# EAGLE schematic Tempura_V2 (EAGLE 9.6.1)
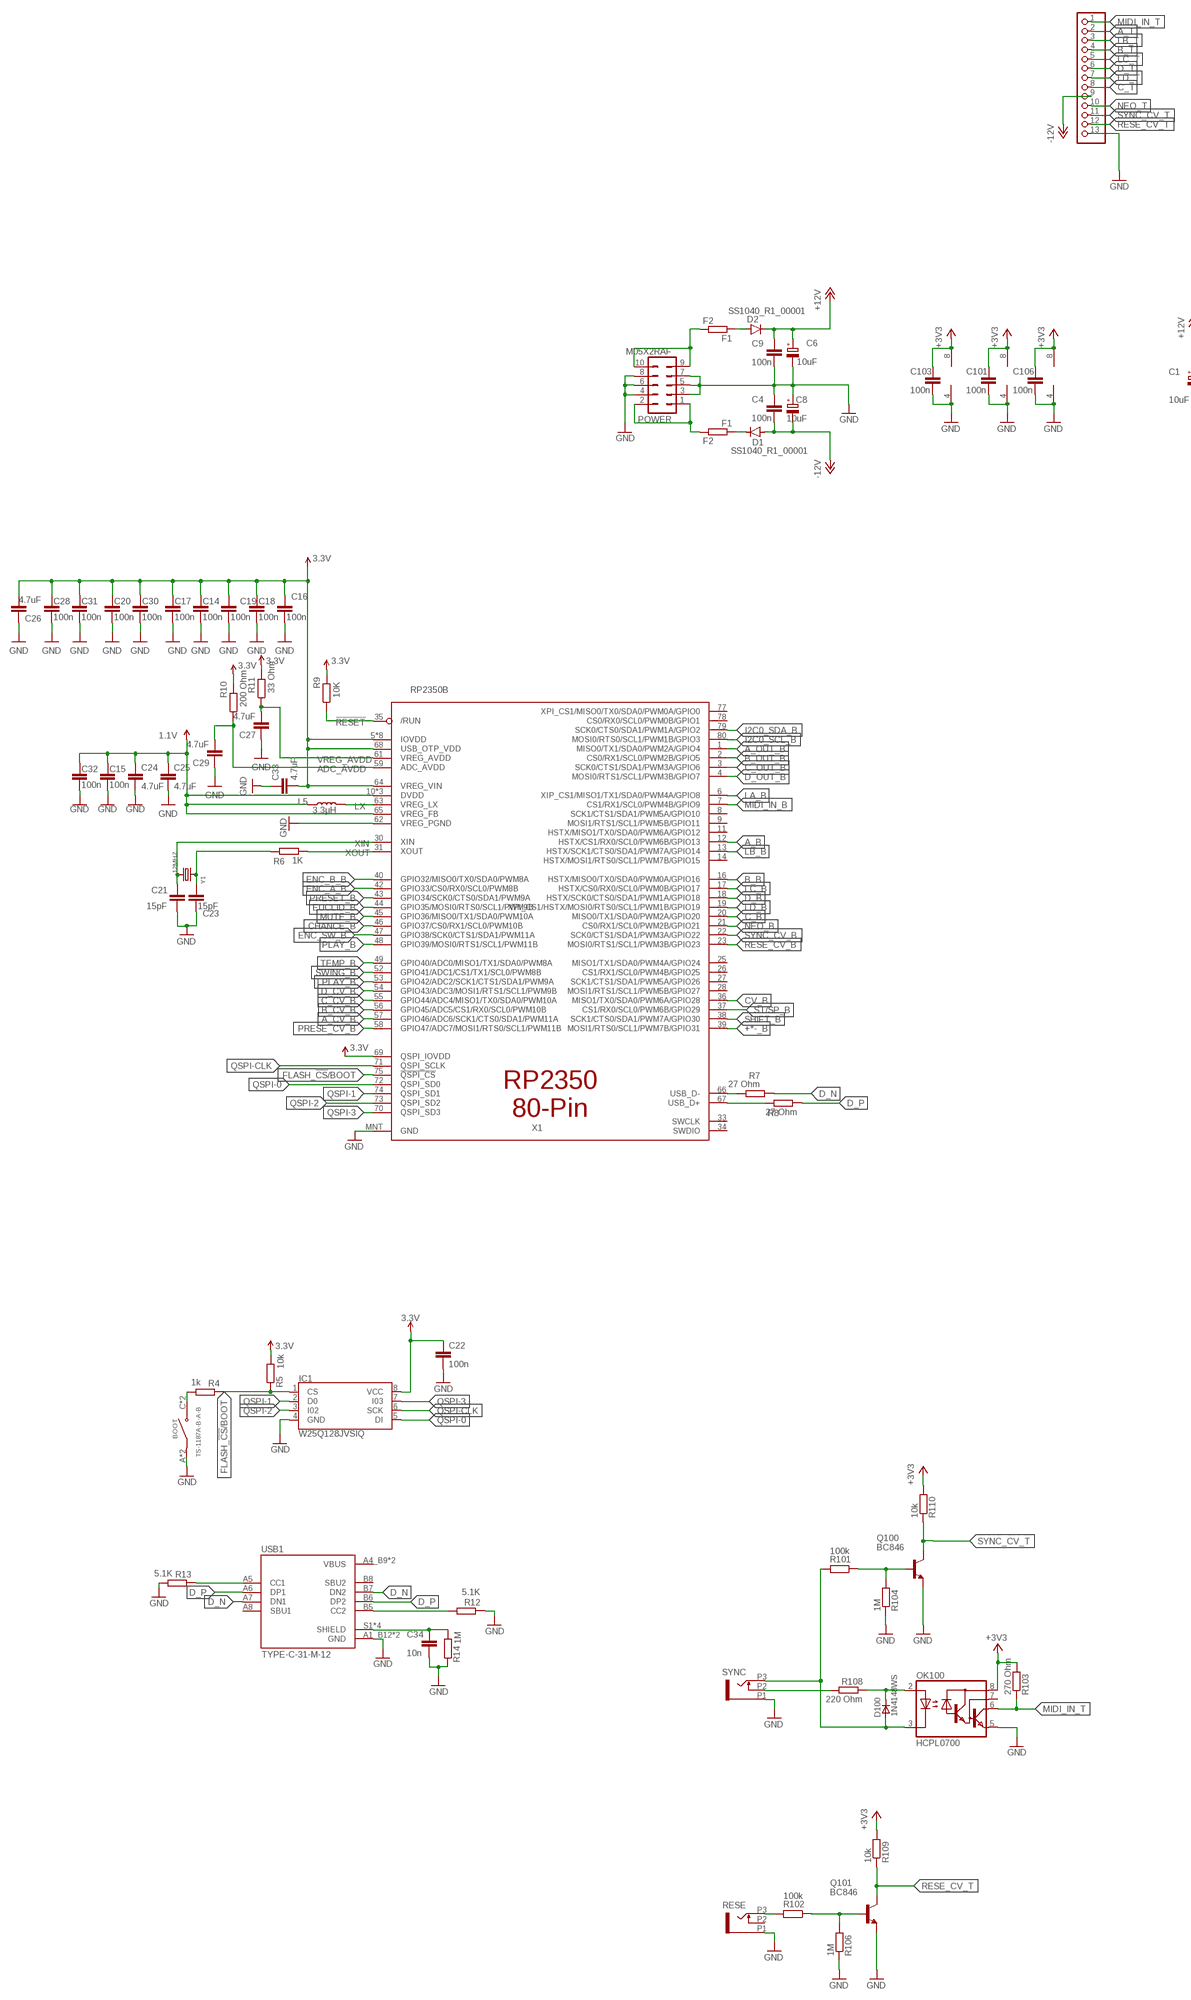
[diagram p0: schematic, sheet 1, part 1 of 3]
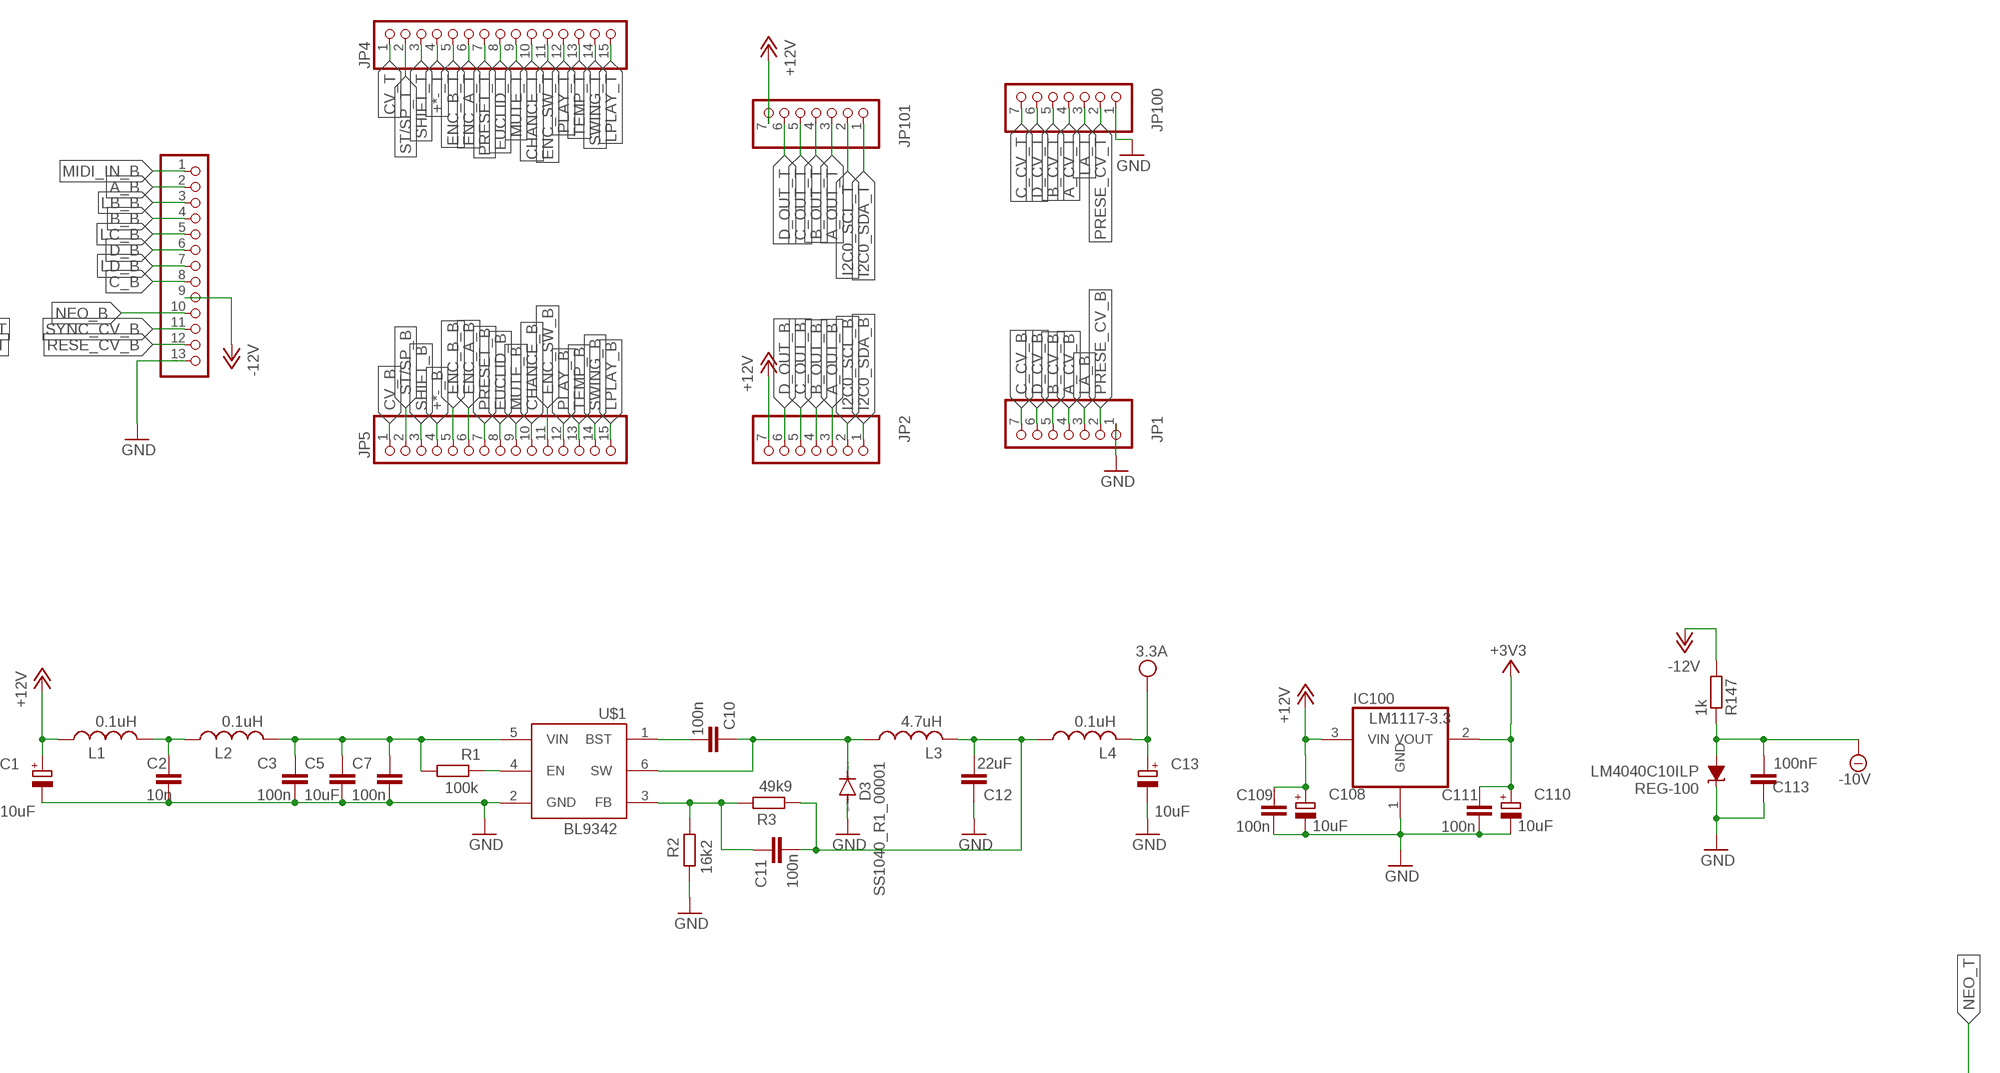
[diagram p1: schematic, sheet 1, part 2 of 3]
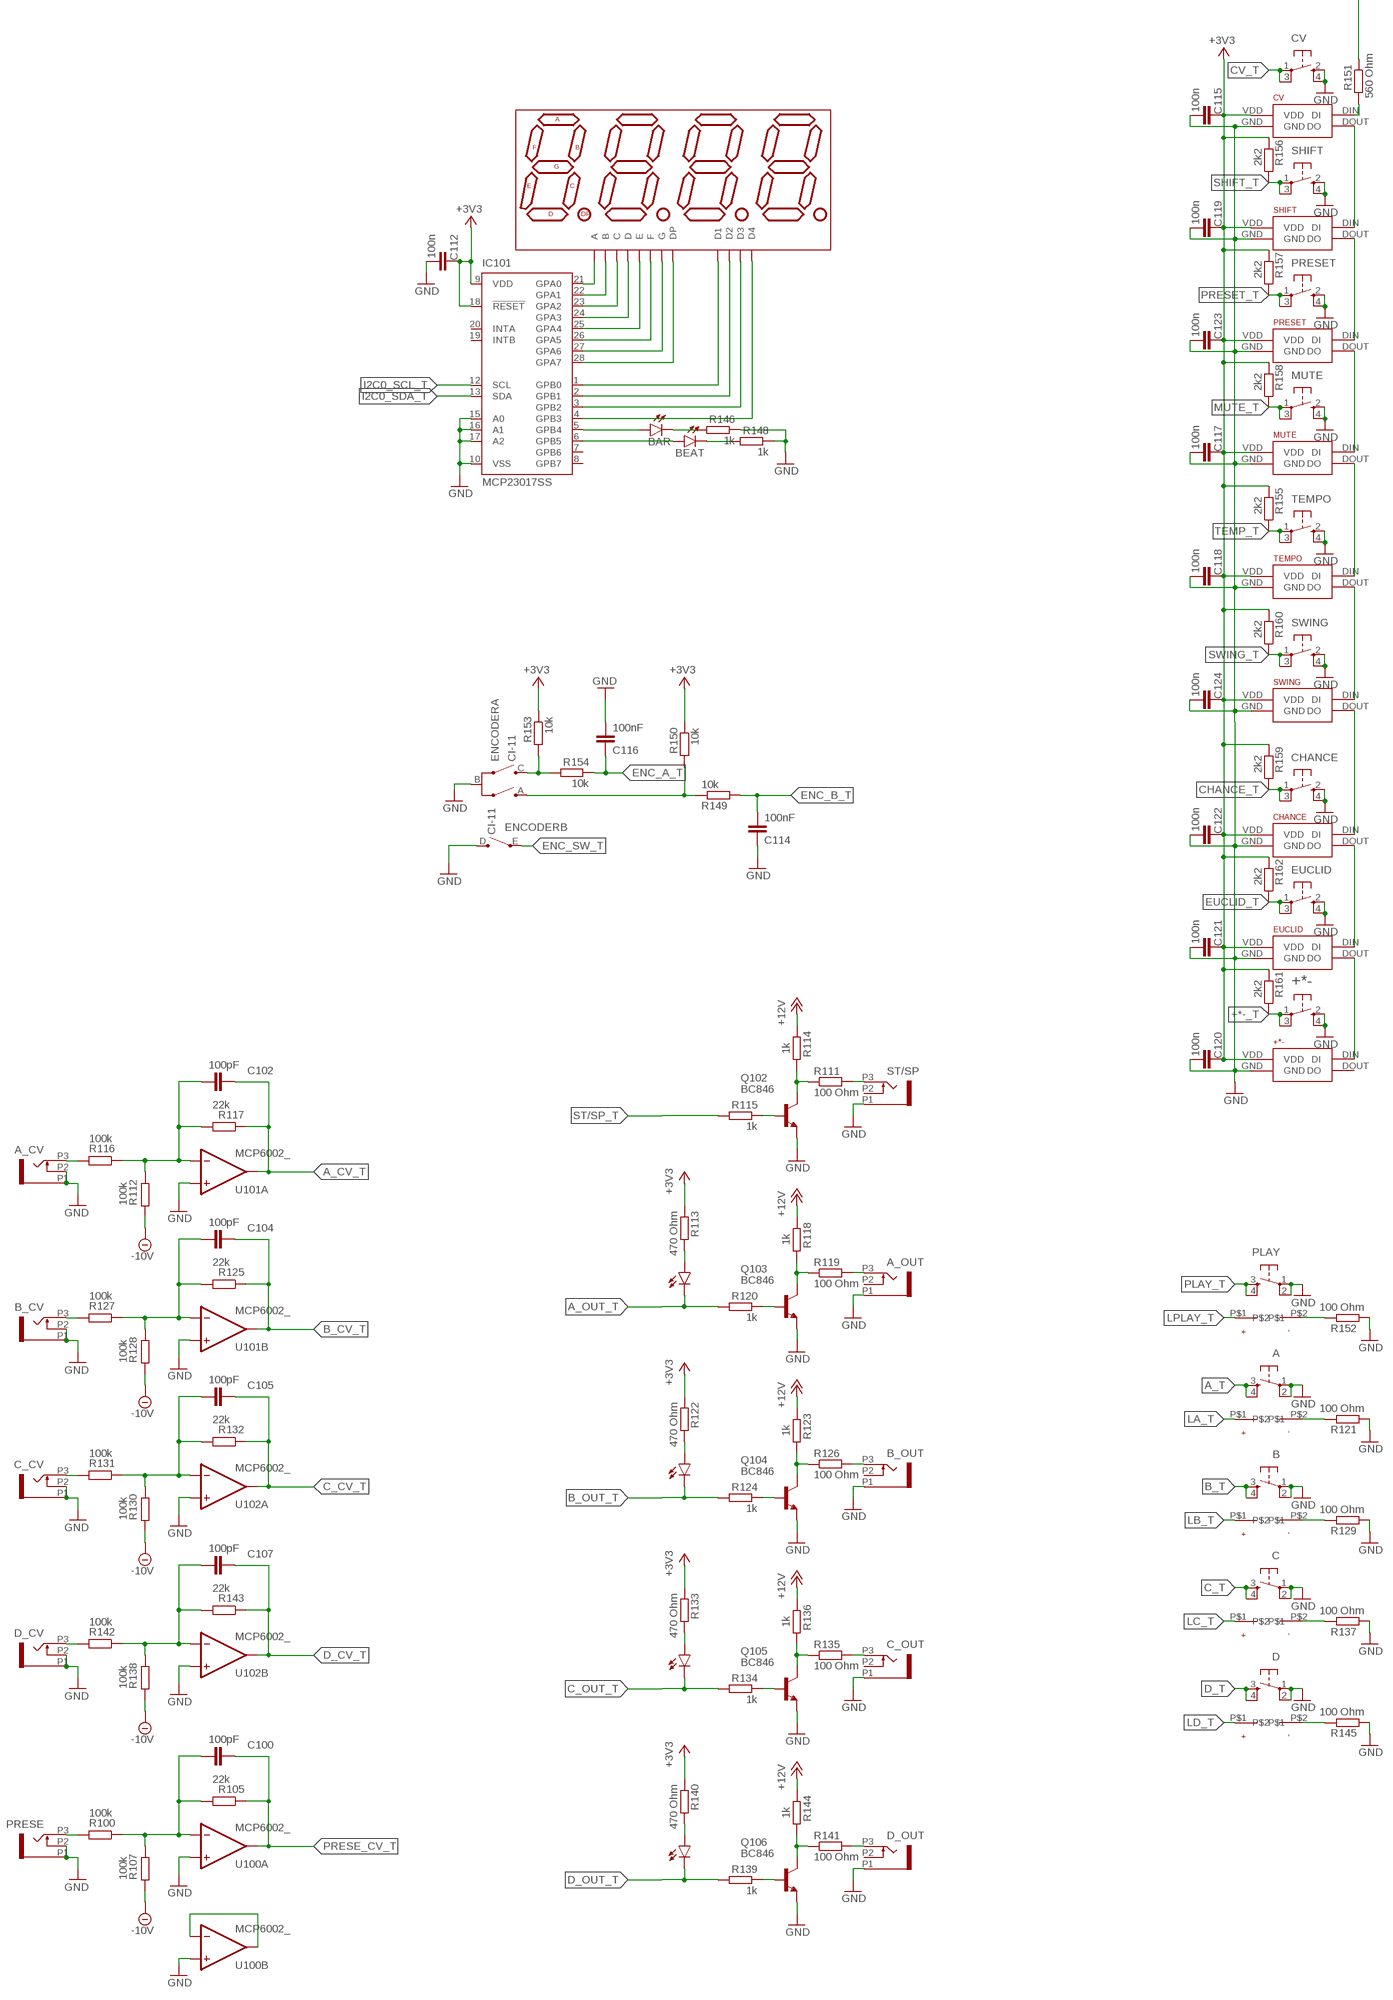
[diagram p2: schematic, sheet 1, part 3 of 3]

## Parts
+*-  BUTTON_NEOPIXELBUTTON_PIXEL_ç  [BUTTON_PIXEL_ç]
A  DTS-6_LED  [TIMEBUTTON_HOLES_LEDS]
A_CV  OG-PJ301_PJ301_THONKICONNNOHOLER  OG-PJ301_PJ301_THONKICONNNOHOLER_GND_SHORT_PADMINI_GND  [NOHOLER_GND_SHORT_PADMINI_GND]
A_OUT  OG-PJ301_PJ301_THONKICONNNOHOLER  OG-PJ301_PJ301_THONKICONNNOHOLER_GND_SHORT_PADMINI_GND  [NOHOLER_GND_SHORT_PADMINI_GND]
B  DTS-6_LED  [TIMEBUTTON_HOLES_LEDS]
B_CV  OG-PJ301_PJ301_THONKICONNNOHOLER  OG-PJ301_PJ301_THONKICONNNOHOLER_GND_SHORT_PADMINI_GND  [NOHOLER_GND_SHORT_PADMINI_GND]
B_OUT  OG-PJ301_PJ301_THONKICONNNOHOLER  OG-PJ301_PJ301_THONKICONNNOHOLER_GND_SHORT_PADMINI_GND  [NOHOLER_GND_SHORT_PADMINI_GND]
BAR  OSG5TA7NE4B  LED3MM  [LED3MM]
BEAT  OSO5JA7NE4B  LED3MM  [LED3MM]
BOOT  TS-1187A-B-A-B  [SW_TS-1187A-B-A-B]
C  DTS-6_LED  [TIMEBUTTON_HOLES_LEDS]
C1  10uF  CPOL-EUB  [PANASONIC_B]
C2  10n  C-EUC0603  [C0603]
C3  100n  C-EUC0603  [C0603]
C4  100n  C-EUC0603  [C0603]
C5  10uF  C-EUC0603  [C0603]
C6  10uF  CPOL-EUB  [PANASONIC_B]
C7  100n  C-EUC0603  [C0603]
C8  10uF  CPOL-EUB  [PANASONIC_B]
C9  100n  C-EUC0603  [C0603]
C10  100n  C-EUC0603  [C0603]
C11  100n  C-EUC0603  [C0603]
C12  22uF  C-EUC0603  [C0603]
C13  10uF  CPOL-EUB  [PANASONIC_B]
C14  100n  0.1UF-0603-100V-10%  [0603]
C15  100n  0.1UF-0603-100V-10%  [0603]
C16  100n  0.1UF-0603-100V-10%  [0603]
C17  100n  0.1UF-0603-100V-10%  [0603]
C18  100n  0.1UF-0603-100V-10%  [0603]
C19  100n  0.1UF-0603-100V-10%  [0603]
C20  100n  0.1UF-0603-100V-10%  [0603]
C21  15pF  0.1UF-0603-100V-10%  [0603]
C22  100n  C-EUC0603  [C0603]
C23  15pF  0.1UF-0603-100V-10%  [0603]
C24  4.7uF  10UF-0603-6.3V-20%  [0603]
C25  4.7uF  10UF-0603-6.3V-20%  [0603]
C26  4.7uF  C-EUC0603  [C0603]
C27  4.7uF  C-EUC0805  [C0805]
C28  100n  0.1UF-0603-100V-10%  [0603]
C29  4.7uF  C-EUC0805  [C0805]
C30  100n  0.1UF-0603-100V-10%  [0603]
C31  100n  0.1UF-0603-100V-10%  [0603]
C32  100n  0.1UF-0603-100V-10%  [0603]
C33  4.7uF  C-EUC0805  [C0805]
C34  10n  C-EUC0603  [C0603]
C100  100pF  C-EUC0603  [C0603]
C101  100n  C-EUC0603  [C0603]
C102  100pF  C-EUC0603  [C0603]
C103  100n  C-EUC0603  [C0603]
C104  100pF  C-EUC0603  [C0603]
C105  100pF  C-EUC0603  [C0603]
C106  100n  C-EUC0603  [C0603]
C107  100pF  C-EUC0603  [C0603]
C108  10uF  CPOL-EUB  [PANASONIC_B]
C109  100n  C-EUC0603  [C0603]
C110  10uF  CPOL-EUB  [PANASONIC_B]
C111  100n  C-EUC0603  [C0603]
C112  100n  C-EUC0603  [C0603]
C113  100nF  C-EUC0603  [C0603]
C114  100nF  C-EUC0603  [C0603]
C115  100n  C-EUC0603  [C0603]
C116  100nF  C-EUC0603  [C0603]
C117  100n  C-EUC0603  [C0603]
C118  100n  C-EUC0603  [C0603]
C119  100n  C-EUC0603  [C0603]
C120  100n  C-EUC0603  [C0603]
C121  100n  C-EUC0603  [C0603]
C122  100n  C-EUC0603  [C0603]
C123  100n  C-EUC0603  [C0603]
C124  100n  C-EUC0603  [C0603]
C_CV  OG-PJ301_PJ301_THONKICONNNOHOLER  OG-PJ301_PJ301_THONKICONNNOHOLER_GND_SHORT_PADMINI_GND  [NOHOLER_GND_SHORT_PADMINI_GND]
C_OUT  OG-PJ301_PJ301_THONKICONNNOHOLER  OG-PJ301_PJ301_THONKICONNNOHOLER_GND_SHORT_PADMINI_GND  [NOHOLER_GND_SHORT_PADMINI_GND]
CHANCE  BUTTON_NEOPIXELBUTTON_PIXEL_ç  [BUTTON_PIXEL_ç]
CV  BUTTON_NEOPIXELBUTTON_PIXEL_ç  [BUTTON_PIXEL_ç]
D  DTS-6_LED  [TIMEBUTTON_HOLES_LEDS]
D1  SS1040_R1_00001  DIODE-SOD123  [SOD123]
D2  SS1040_R1_00001  DIODE-SOD123  [SOD123]
D3  SS1040_R1_00001  DIODE-SOD123  [SOD123]
D100  1N4148WS  [SOD323F]
D_CV  OG-PJ301_PJ301_THONKICONNNOHOLER  OG-PJ301_PJ301_THONKICONNNOHOLER_GND_SHORT_PADMINI_GND  [NOHOLER_GND_SHORT_PADMINI_GND]
D_OUT  OG-PJ301_PJ301_THONKICONNNOHOLER  OG-PJ301_PJ301_THONKICONNNOHOLER_GND_SHORT_PADMINI_GND  [NOHOLER_GND_SHORT_PADMINI_GND]
ENCODER  CI-11  [CI-11]
EUCLID  BUTTON_NEOPIXELBUTTON_PIXEL_ç  [BUTTON_PIXEL_ç]
F1  F2  R-EU_R0603  [R0603]
F2  F1  R-EU_R0603  [R0603]
IC1  W25Q128JVSIQ  [SOIC-8]
IC100  LM1117-3.3  REG1117  [SOT223]
IC101  MCP23017SS  [SSOP28]
JP1  PINHD-1X7ç  [1X07ç]
JP2  PINHD-1X7ç  [1X07ç]
JP3  PINHD-1X131X13ç  [1X13ç]
JP4  PINHD-1X151X15ç  [1X15ç]
JP5  PINHD-1X151X15ç  [1X15ç]
JP100  PINHD-1X7ç  [1X07ç]
JP101  PINHD-1X7ç  [1X07ç]
JP102  PINHD-1X131X13ç  [1X13ç]
L1  0.1uH  L-USL3225P  [L3225P]
L2  0.1uH  L-USL3225P  [L3225P]
L3  4.7uH  L-USL3225P  [L3225P]
L4  0.1uH  L-USL3225P  [L3225P]
L5  3.3μH  4.7μH_SHIELDED_INDUCTOR  [1008(2520)]
LED_A_OUT  2 MM LED  LED3MM  [LED3MM]
LED_B_OUT  2 MM LED  LED3MM  [LED3MM]
LED_C_OUT  2 MM LED  LED3MM  [LED3MM]
LED_D_OUT  2 MM LED  LED3MM  [LED3MM]
LFD36BUE-101B  7-SEGMENT-4DIGIT-20MM  [7-SEGMENT-4DIGIT-30MM]
MUTE  BUTTON_NEOPIXELBUTTON_PIXEL_ç  [BUTTON_PIXEL_ç]
OK100  HCPL0700  [SOIC08]
PLAY  DTS-6_LED  [TIMEBUTTON_HOLES_LEDS]
POWER  M05X2RAF  [2X5-POWER_ACODADO]
PRESE  OG-PJ301_PJ301_THONKICONNNOHOLER  OG-PJ301_PJ301_THONKICONNNOHOLER_GND_SHORT_PADMINI_GND  [NOHOLER_GND_SHORT_PADMINI_GND]
PRESET  BUTTON_NEOPIXELBUTTON_PIXEL_ç  [BUTTON_PIXEL_ç]
Q100  BC846  [SOT23]
Q101  BC846  [SOT23]
Q102  BC846  [SOT23]
Q103  BC846  [SOT23]
Q104  BC846  [SOT23]
Q105  BC846  [SOT23]
Q106  BC846  [SOT23]
R1  100k  R-EU_R0603  [R0603]
R2  16k2  R-EU_R0603  [R0603]
R3  49k9  R-EU_R0603  [R0603]
R4  1k  R-EU_R0603  [R0603]
R5  10k  R-EU_R0603  [R0603]
R6  1K  R-EU_R0603  [R0603]
R7  27 Ohm  R-EU_R0603  [R0603]
R8  27 Ohm  R-EU_R0603  [R0603]
R9  10K  R-EU_R0603  [R0603]
R10  200 Ohm  R-EU_R0603  [R0603]
R11  33 Ohm  R-EU_R0603  [R0603]
R12  5.1K  R-EU_R0603  [R0603]
R13  5.1K  R-EU_R0603  [R0603]
R14  1M  R-EU_R0603  [R0603]
R100  100k  R-EU_R0603  [R0603]
R101  100k  R-EU_R0603  [R0603]
R102  100k  R-EU_R0603  [R0603]
R103  270 Ohm  R-EU_R0603  [R0603]
R104  1M  R-EU_R0603  [R0603]
R105  22k  R-EU_R0603  [R0603]
R106  1M  R-EU_R0603  [R0603]
R107  100k  R-EU_R0603  [R0603]
R108  220 Ohm  R-EU_R0603  [R0603]
R109  10k  R-EU_R0603  [R0603]
R110  10k  R-EU_R0603  [R0603]
R111  100 Ohm  R-EU_R0603  [R0603]
R112  100k  R-EU_R0603  [R0603]
R113  470 Ohm  R-EU_R0603  [R0603]
R114  1k  R-EU_R0603  [R0603]
R115  1k  R-EU_R0603  [R0603]
R116  100k  R-EU_R0603  [R0603]
R117  22k  R-EU_R0603  [R0603]
R118  1k  R-EU_R0603  [R0603]
R119  100 Ohm  R-EU_R0603  [R0603]
R120  1k  R-EU_R0603  [R0603]
R121  100 Ohm  R-EU_R0603  [R0603]
R122  470 Ohm  R-EU_R0603  [R0603]
R123  1k  R-EU_R0603  [R0603]
R124  1k  R-EU_R0603  [R0603]
R125  22k  R-EU_R0603  [R0603]
R126  100 Ohm  R-EU_R0603  [R0603]
R127  100k  R-EU_R0603  [R0603]
R128  100k  R-EU_R0603  [R0603]
R129  100 Ohm  R-EU_R0603  [R0603]
R130  100k  R-EU_R0603  [R0603]
R131  100k  R-EU_R0603  [R0603]
R132  22k  R-EU_R0603  [R0603]
R133  470 Ohm  R-EU_R0603  [R0603]
R134  1k  R-EU_R0603  [R0603]
R135  100 Ohm  R-EU_R0603  [R0603]
R136  1k  R-EU_R0603  [R0603]
R137  100 Ohm  R-EU_R0603  [R0603]
R138  100k  R-EU_R0603  [R0603]
R139  1k  R-EU_R0603  [R0603]
R140  470 Ohm  R-EU_R0603  [R0603]
R141  100 Ohm  R-EU_R0603  [R0603]
R142  100k  R-EU_R0603  [R0603]
R143  22k  R-EU_R0603  [R0603]
R144  1k  R-EU_R0603  [R0603]
R145  100 Ohm  R-EU_R0603  [R0603]
R146  1k  R-EU_R0603  [R0603]
R147  1k  R-EU_R0603  [R0603]
R148  1k  R-EU_R0603  [R0603]
R149  10k  R-EU_R0603  [R0603]
R150  10k  R-EU_R0603  [R0603]
R151  560 Ohm  R-EU_R0603  [R0603]
R152  100 Ohm  R-EU_R0603  [R0603]
R153  10k  R-EU_R0603  [R0603]
R154  10k  R-EU_R0603  [R0603]
R155  2k2  R-EU_R0603  [R0603]
R156  2k2  R-EU_R0603  [R0603]
R157  2k2  R-EU_R0603  [R0603]
R158  2k2  R-EU_R0603  [R0603]
R159  2k2  R-EU_R0603  [R0603]
R160  2k2  R-EU_R0603  [R0603]
R161  2k2  R-EU_R0603  [R0603]
R162  2k2  R-EU_R0603  [R0603]
REG-100  LM4040C10ILP  LM4041A12DBZ  [DBZ_R-PDSO-G3]
RESE  OG-PJ301_PJ301_THONKICONNNOHOLER  OG-PJ301_PJ301_THONKICONNNOHOLER_GND_SHORT_PADMINI_GND  [NOHOLER_GND_SHORT_PADMINI_GND]
SHIFT  BUTTON_NEOPIXELBUTTON_PIXEL_ç  [BUTTON_PIXEL_ç]
ST/SP  OG-PJ301_PJ301_THONKICONNNOHOLER  OG-PJ301_PJ301_THONKICONNNOHOLER_GND_SHORT_PADMINI_GND  [NOHOLER_GND_SHORT_PADMINI_GND]
SWING  BUTTON_NEOPIXELBUTTON_PIXEL_ç  [BUTTON_PIXEL_ç]
SYNC  OG-PJ301_PJ301_THONKICONNNOHOLER  OG-PJ301_PJ301_THONKICONNNOHOLER_GND_SHORT_PADMINI_GND  [NOHOLER_GND_SHORT_PADMINI_GND]
TEMPO  BUTTON_NEOPIXELBUTTON_PIXEL_ç  [BUTTON_PIXEL_ç]
U100  MCP6002_  [SO08]
U101  MCP6002_  [SO08]
U102  MCP6002_  [SO08]
U$1  BL9342  [SOT23-6]
USB1  TYPE-C-31-M-12  [HRO_TYPE-C-31-M-12]
X1  RP2350B  [QFN80]
Y1  12MHZ  CRYSTAL3.2X2.5  [CRYSTAL_3.2X2.5]

## Nets
1.1V: C15.1 C24.1 C25.1 C32.1 L5.1 X1.10(DVDD) X1.32(DVDD) X1.51(DVDD) X1.65(VREG_FB)
!RESET: R9.1 X1.35(/RUN)
+3V3: +*-.VDD C101.1 C103.1 C106.1 C110.+ C111.1 C112.1 C115.1 C117.1 C118.1 C119.1 C120.1 C121.1 C122.1 C123.1 C124.1 CHANCE.VDD CV.VDD EUCLID.VDD IC100.2(VOUT) IC101.9(VDD) IC101.18(!RESET) MUTE.VDD OK100.8(VCC) PRESET.VDD R103.2 R109.2 R110.2 R113.1 R122.1 R133.1 R140.1 R150.1 R153.1 R155.2 R156.2 R157.2 R158.2 R159.2 R160.2 R161.2 R162.2 SHIFT.VDD SWING.VDD TEMPO.VDD U100.8(P:V+) U101.8(P:V+) U102.8(P:V+)
+12V: C1.+ C6.+ C9.1 C108.+ C109.1 D2.C IC100.3(VIN) JP2.7 JP101.7 L1.1 R114.1 R118.1 R123.1 R136.1 R144.1
+*-_B: JP5.4 X1.39(MOSI1/RTS0/SCL1/PWM7B/GPIO31)
+*-_T: +*-.1 +*-.3 JP4.4 R161.1
-10V: C113.2 R107.2 R112.2 R128.2 R130.2 R138.2 R147.1 REG-100.2(A)
-12V: C4.2 C8.- D1.A JP3.9 JP102.9 R147.2
A_B: JP3.2 X1.12(HSTX/CS1/RX0/SCL0/PWM6B/GPIO13)
A_CV_B: JP1.4 X1.57(GPIO46/ADC6/SCK1/CTS0/SDA1/PWM11A)
A_CV_T: C102.2 JP100.4 R117.1 U101.1(A:OUT)
A_OUT_B: JP2.3 X1.1(MISO0/TX1/SDA0/PWM2A/GPIO4)
A_OUT_T: JP101.3 LED_A_OUT.K(C) R120.2
A_T: A.3 A.4 JP102.2
ADC_AVDD: C29.2 R10.1 X1.59(ADC_AVDD)
B_B: JP3.4 X1.16(HSTX/MISO0/TX0/SDA0/PWM0A/GPIO16)
B_CV_B: JP1.5 X1.56(GPIO45/ADC5/CS1/RX0/SCL0/PWM10B)
B_CV_T: C104.2 JP100.5 R125.1 U101.7(B:OUT)
B_OUT_B: JP2.4 X1.2(CS0/RX1/SCL0/PWM2B/GPIO5)
B_OUT_T: JP101.4 LED_B_OUT.K(C) R124.2
B_T: B.3 B.4 JP102.4
C_B: JP3.8 X1.20(MISO0/TX1/SDA0/PWM2A/GPIO20)
C_CV_B: JP1.7 X1.55(GPIO44/ADC4/MISO1/TX0/SDA0/PWM10A)
C_CV_T: C105.2 JP100.7 R132.1 U102.1(A:OUT)
C_OUT_B: JP2.5 X1.3(SCK0/CTS1/SDA1/PWM3A/GPIO6)
C_OUT_T: JP101.5 LED_C_OUT.K(C) R134.2
C_T: C.3 C.4 JP102.8
CHANCE_B: JP5.10 X1.46(GPIO37/CS0/RX1/SCL0/PWM10B)
CHANCE_T: CHANCE.1 CHANCE.3 JP4.10 R159.1
CV_B: JP5.1 X1.36(MISO1/TX0/SDA0/PWM6A/GPIO28)
CV_T: CV.1 CV.3 JP4.1
D_B: JP3.6 X1.18(HSTX/SCK0/CTS0/SDA1/PWM1A/GPIO18)
D_CV_B: JP1.6 X1.54(GPIO43/ADC3/MOSI1/RTS1/SCL1/PWM9B)
D_CV_T: C107.2 JP100.6 R143.1 U102.7(B:OUT)
D_N: R7.1 USB1.A7(DN1) USB1.B7(DN2)
D_OUT_B: JP2.6 X1.4(MOSI0/RTS1/SCL1/PWM3B/GPIO7)
D_OUT_T: JP101.6 LED_D_OUT.K(C) R139.2
D_P: R8.1 USB1.A6(DP1) USB1.B6(DP2)
D_T: D.3 D.4 JP102.6
DO_N: R7.2 X1.66(USB_D-)
DO_P: R8.2 X1.67(USB_D+)
ENC_A_B: JP5.6 X1.42(GPIO33/CS0/RX0/SCL0/PWM8B)
ENC_A_T: C116.1 JP4.6 R154.1
ENC_B_B: JP5.5 X1.40(GPIO32/MISO0/TX0/SDA0/PWM8A)
ENC_B_T: C114.2 JP4.5 R149.2
ENC_SW_B: JP5.11 X1.47(GPIO38/SCK0/CTS1/SDA1/PWM11A)
ENC_SW_T: ENCODER.E(B:E) JP4.11
EUCLID_B: JP5.8 X1.44(GPIO35/MOSI0/RTS0/SCL1/PWM9B)
EUCLID_T: EUCLID.1 EUCLID.3 JP4.8 R162.1
FLASH_!CS!/BOOT: IC1.1(CS) R4.1 R5.1 X1.75(!QSPI_CS)
GND: +*-.2 +*-.4 +*-.GND A.1 A.2 A_CV.P1 A_CV.P2 A_OUT.P1 B.1 B.2 B_CV.P1 B_CV.P2 B_OUT.P1 BOOT.A(COM) BOOT.B(COM) C1.- C2.2 C3.2 C4.1 C5.2 C6.- C7.2 C8.+ C9.2 C12.1 C13.- C14.2 C15.2 C16.2 C17.2 C18.2 C19.2 C20.2 C21.2 C22.2 C23.2 C24.2 C25.2 C26.1 C27.1 C28.2 C29.1 C30.2 C31.2 C32.2 C33.1 C34.2 C101.2 C103.2 C106.2 C108.- C109.2 C110.- C111.2 C112.2 C113.1 C114.1 C115.2 C116.2 C117.2 C118.2 C119.2 C120.2 C121.2 C122.2 C123.2 C124.2 C.1 C.2 C_CV.P1 C_CV.P2 C_OUT.P1 CHANCE.2 CHANCE.4 CHANCE.GND CV.2 CV.4 CV.GND D3.A D.1 D.2 D_CV.P1 D_CV.P2 D_OUT.P1 ENCODER.B(A:C) ENCODER.D(B:D) EUCLID.2 EUCLID.4 EUCLID.GND IC1.4(GND) IC100.1(GND) IC101.10(VSS) IC101.15(A0) IC101.16(A1) IC101.17(A2) JP1.1 JP3.13 JP100.1 JP102.13 MUTE.2 MUTE.4 MUTE.GND OK100.5(GND) PLAY.1 PLAY.2 POWER.3 POWER.4 POWER.5 POWER.6 POWER.7 POWER.8 PRESE.P1 PRESE.P2 PRESET.2 PRESET.4 PRESET.GND Q100.2(E) Q101.2(E) Q102.2(E) Q103.2(E) Q104.2(E) Q105.2(E) Q106.2(E) R2.1 R12.1 R13.2 R14.1 R104.1 R106.1 R121.2 R129.2 R137.2 R145.2 R146.1 R148.1 R152.2 REG-100.1(C) RESE.P1 SHIFT.2 SHIFT.4 SHIFT.GND ST/SP.P1 SWING.2 SWING.4 SWING.GND SYNC.P1 TEMPO.2 TEMPO.4 TEMPO.GND U100.3(A:+IN) U100.4(P:V-) U100.5(B:+IN) U101.3(A:+IN) U101.4(P:V-) U101.5(B:+IN) U102.3(A:+IN) U102.4(P:V-) U102.5(B:+IN) U$1.2(GND) USB1.A1_B12(GND) USB1.B1_A12(GND) X1.62(VREG_PGND) X1.MNT(GND)
I2C0_SCL_B: JP2.2 X1.80(MOSI0/RTS0/SCL1/PWM1B/GPIO3)
I2C0_SCL_T: IC101.12(SCL) JP101.2
I2C0_SDA_B: JP2.1 X1.79(SCK0/CTS0/SDA1/PWM1A/GPIO2)
I2C0_SDA_T: IC101.13(SDA) JP101.1
LA_B: JP1.3 X1.6(XIP_CS1/MISO1/TX1/SDA0/PWM4A/GPIO8)
LA_T: A.P$1 JP100.3
LB_B: JP3.3 X1.13(HSTX/SCK1/CTS0/SDA1/PWM7A/GPIO14)
LB_T: B.P$1 JP102.3
LC_B: JP3.5 X1.17(HSTX/CS0/RX0/SCL0/PWM0B/GPIO17)
LC_T: C.P$1 JP102.5
LD_B: JP3.7 X1.19(XPI_CS1/HSTX/MOSI0/RTS0/SCL1/PWM1B/GPIO19)
LD_T: D.P$1 JP102.7
LPLAY_B: JP5.15 X1.53(GPIO42/ADC2/SCK1/CTS1/SDA1/PWM9A)
LPLAY_T: JP4.15 PLAY.P$1
LX: L5.2 X1.63(VREG_LX)
MIDI_IN_B: JP3.1 X1.7(CS1/RX1/SCL0/PWM4B/GPIO9)
MIDI_IN_T: JP102.1 OK100.6(VO) R103.1
MUTE_B: JP5.9 X1.45(GPIO36/MISO0/TX1/SDA0/PWM10A)
MUTE_T: JP4.9 MUTE.1 MUTE.3 R158.1
N$4: R1.2 U$1.4(EN)
N$5: C3.1 C5.1 C7.1 L2.2 R1.1 U$1.5(VIN)
N$6: C2.1 L1.2 L2.1
N$7: C10.2 U$1.1(BST)
N$8: C10.1 D3.C L3.1 U$1.6(SW)
N$9: C11.1 R2.2 R3.2 U$1.3(FB)
N$10: C11.2 C12.2 L3.2 L4.1 R3.1
N$11: IC101.21(GPA0) LFD36BUE-101B.11(A)
N$13: BAR.A IC101.5(GPB4)
N$15: D100.C OK100.2(A) R108.1
N$16: IC101.22(GPA1) LFD36BUE-101B.7(B)
N$18: IC101.23(GPA2) LFD36BUE-101B.4(C)
N$19: IC101.24(GPA3) LFD36BUE-101B.2(D)
N$20: IC101.25(GPA4) LFD36BUE-101B.1(E)
N$21: IC101.26(GPA5) LFD36BUE-101B.10(F)
N$22: IC101.27(GPA6) LFD36BUE-101B.5(G)
N$23: IC101.28(GPA7) LFD36BUE-101B.3(DP)
N$24: IC101.1(GPB0) LFD36BUE-101B.12(D1)
N$25: IC101.2(GPB1) LFD36BUE-101B.9(D2)
N$26: IC101.3(GPB2) LFD36BUE-101B.8(D3)
N$27: IC101.4(GPB3) LFD36BUE-101B.6(D4)
N$28: C102.1 R112.1 R116.1 R117.2 U101.2(A:-IN)
N$29: CV.DIN(DI) R151.2
N$30: CV.DOUT(DO) SHIFT.DIN(DI)
N$31: PRESET.DIN(DI) SHIFT.DOUT(DO)
N$32: MUTE.DIN(DI) PRESET.DOUT(DO)
N$33: MUTE.DOUT(DO) TEMPO.DIN(DI)
N$34: CHANCE.DOUT(DO) EUCLID.DIN(DI)
N$35: +*-.DIN(DI) EUCLID.DOUT(DO)
N$36: U100.6(B:-IN) U100.7(B:OUT)
N$37: C104.1 R125.2 R127.1 R128.1 U101.6(B:-IN)
N$38: C105.1 R130.1 R131.1 R132.2 U102.2(A:-IN)
N$39: C107.1 R138.1 R142.1 R143.2 U102.6(B:-IN)
N$40: PLAY.P$2 R152.1
N$41: A.P$2 R121.1
N$42: B.P$2 R129.1
N$43: F2.2 POWER.9 POWER.10
N$44: D2.A F2.1
N$45: F1.2 POWER.1 POWER.2
N$46: D1.C F1.1
N$47: C.P$2 R137.1
N$48: D.P$2 R145.1
N$49: A_OUT.P3 R119.2
N$50: B_OUT.P3 R126.2
N$51: Q100.1(B) R101.1 R104.2
N$52: C_OUT.P3 R135.2
N$53: Q101.1(B) R102.1 R106.2
N$54: D_OUT.P3 R141.2
N$55: Q102.1(B) R115.1
N$56: A_CV.P3 R116.2
N$57: B_CV.P3 R127.2
N$58: C_CV.P3 R131.2
N$59: D_CV.P3 R142.2
N$60: R111.2 ST/SP.P3
N$61: Q102.3(C) R111.1 R114.2
N$62: D100.A OK100.3(C) R101.2 SYNC.P3
N$63: PRESE.P3 R100.2
N$64: R102.2 RESE.P3
N$65: ENCODER.A(A:A) R149.1 R150.2
N$66: ENCODER.C(A:B) R153.2 R154.2
N$67: BAR.K(C) R146.2
N$68: BEAT.A IC101.6(GPB5)
N$69: BEAT.K(C) R148.2
N$71: CHANCE.DIN(DI) SWING.DOUT(DO)
N$72: C100.1 R100.1 R105.2 R107.1 U100.2(A:-IN)
N$75: Q103.1(B) R120.1
N$76: Q103.3(C) R118.2 R119.1
N$77: LED_A_OUT.A R113.2
N$78: R108.2 SYNC.P2
N$79: Q104.1(B) R124.1
N$80: Q104.3(C) R123.2 R126.1
N$81: LED_B_OUT.A R122.2
N$83: Q105.1(B) R134.1
N$84: Q105.3(C) R135.1 R136.2
N$85: LED_C_OUT.A R133.2
N$87: Q106.1(B) R139.1
N$88: Q106.3(C) R141.1 R144.2
N$89: LED_D_OUT.A R140.2
N$95: SWING.DIN(DI) TEMPO.DOUT(DO)
N$111: C23.1 R6.2 Y1.2
N$112: BOOT.C(NO) BOOT.D(NO) R4.2
N$113: C34.1 R14.2 USB1.S1(SHIELD) USB1.S2(SHIELD) USB1.S3(SHIELD) USB1.S4(SHIELD)
N$114: R13.1 USB1.A5(CC1)
N$115: R12.2 USB1.B5(CC2)
NEO_B: JP3.10 X1.21(CS0/RX1/SCL0/PWM2B/GPIO21)
NEO_T: JP102.10 R151.1
PLAY_B: JP5.12 X1.48(GPIO39/MOSI0/RTS1/SCL1/PWM11B)
PLAY_T: JP4.12 PLAY.3 PLAY.4
PRESE_CV_B: JP1.2 X1.58(GPIO47/ADC7/MOSI1/RTS0/SCL1/PWM11B)
PRESE_CV_T: C100.2 JP100.2 R105.1 U100.1(A:OUT)
PRESET_B: JP5.7 X1.43(GPIO34/SCK0/CTS0/SDA1/PWM9A)
PRESET_T: JP4.7 PRESET.1 PRESET.3 R157.1
QSPI-0: IC1.5(DI) X1.72(QSPI_SD0)
QSPI-1: IC1.2(D0) X1.74(QSPI_SD1)
QSPI-2: IC1.3(I02) X1.73(QSPI_SD2)
QSPI-3: IC1.7(I03) X1.70(QSPI_SD3)
QSPI-CLK: IC1.6(SCK) X1.71(QSPI_SCLK)
RESE_CV_B: JP3.12 X1.23(MOSI0/RTS1/SCL1/PWM3B/GPIO23)
RESE_CV_T: JP102.12 Q101.3(C) R109.1
SHIFT_B: JP5.3 X1.38(SCK1/CTS0/SDA1/PWM7A/GPIO30)
SHIFT_T: JP4.3 R156.1 SHIFT.1 SHIFT.3
ST/SP_B: JP5.2 X1.37(CS1/RX0/SCL0/PWM6B/GPIO29)
ST/SP_T: JP4.2 R115.2
SWING_B: JP5.14 X1.52(GPIO41/ADC1/CS1/TX1/SCL0/PWM8B)
SWING_T: JP4.14 R160.1 SWING.1 SWING.3
SYNC_CV_B: JP3.11 X1.22(SCK0/CTS1/SDA1/PWM3A/GPIO22)
SYNC_CV_T: JP102.11 Q100.3(C) R110.1
TEMP_B: JP5.13 X1.49(GPIO40/ADC0/MISO1/TX1/SDA0/PWM8A)
TEMP_T: JP4.13 R155.1 TEMPO.1 TEMPO.3
VCC: C13.+ C14.1 C16.1 C17.1 C18.1 C19.1 C20.1 C22.1 C26.2 C28.1 C30.1 C31.1 C33.2 IC1.8(VCC) L4.2 R5.2 R9.2 R10.2 R11.2 X1.5(IOVDD) X1.15(IOVDD) X1.24(IOVDD) X1.29(IOVDD) X1.41(IOVDD) X1.50(IOVDD) X1.60(IOVDD) X1.64(VREG_VIN) X1.68(USB_OTP_VDD) X1.69(QSPI_IOVDD) X1.76(IOVDD) ; supply symbol labelled 3.3A, 3.3V
VREG_AVDD: C27.2 R11.1 X1.61(VREG_AVDD)
XIN: C21.1 X1.30(XIN) Y1.1
XOUT: R6.1 X1.31(XOUT)
Unconnected: +*-.DOUT(DO) A_OUT.P2 B_OUT.P2 C_OUT.P2 D_OUT.P2 IC101.7(GPB6) IC101.8(GPB7) IC101.19(INTB) IC101.20(INTA) OK100.7(VB) RESE.P2 ST/SP.P2 USB1.A8(SBU1) USB1.B8(SBU2) X1.8(SCK1/CTS1/SDA1/PWM5A/GPIO10) X1.9(MOSI1/RTS1/SCL1/PWM5B/GPIO11) X1.11(HSTX/MISO1/TX0/SDA0/PWM6A/GPIO12) X1.14(HSTX/MOSI1/RTS0/SCL1/PWM7B/GPIO15) X1.25(MISO1/TX1/SDA0/PWM4A/GPIO24) X1.26(CS1/RX1/SCL0/PWM4B/GPIO25) X1.27(SCK1/CTS1/SDA1/PWM5A/GPIO26) X1.28(MOSI1/RTS1/SCL1/PWM5B/GPIO27) X1.33(SWCLK) X1.34(SWDIO) X1.77(XPI_CS1/MISO0/TX0/SDA0/PWM0A/GPIO0) X1.78(CS0/RX0/SCL0/PWM0B/GPIO1)

## Power pins joined to a net without a drawn wire
VBUS: USB1.A4_B9(VBUS) USB1.B4_A9(VBUS)

## Library data of the parts
+*- CHANCE CV EUCLID MUTE PRESET SHIFT SWING TEMPO = switch-tact:BUTTON_NEOPIXEL
A B C D PLAY = switch-tact:DTS-6_LED
A_CV A_OUT B_CV B_OUT C_CV C_OUT D_CV D_OUT PRESE RESE ST/SP SYNC = Thonkikonn:OG-PJ301_PJ301_THONKICONN
BAR BEAT LED_A_OUT LED_B_OUT LED_C_OUT LED_D_OUT = led:LED: LED OSRAM: - CHIPLED LG R971, LG N971, LY N971, LG Q971, LY Q971, LO R971, LY R971 LH N974, LH R974 LS Q976, LO Q976, LY Q976 LO Q996 - Hyper CHIPLED LW Q18S LB Q993, LB Q99A, LB R99A - SideLED LS A670, LO A670, LY A670, LG A670, LP A670 LB A673, LV A673, LT A673, LW A673 LH A674 LY A675 LS A676, LA A676, LO A676, LY A676, LW A676 LS A679, LY A679, LG A679 - Hyper Micro SIDELED® LS Y876, LA Y876, LO Y876, LY Y876 LT Y87S - SmartLED LW L88C, LW L88S LB L89C, LB L89S, LG L890 LS L89K, LO L89K, LY L89K LS L896, LA L896, LO L896, LY L896 - TOPLED LS T670, LO T670, LY T670, LG T670, LP T670 LSG T670, LSP T670, LSY T670, LOP T670, LYG T670 LG T671, LOG T671, LSG T671 LB T673, LV T673, LT T673, LW T673 LH T674 LS T676, LA T676, LO T676, LY T676, LB T676, LH T676, LSB T676, LW T676 LB T67C, LV T67C, LT T67C, LS T67K, LO T67K, LY T67K, LW E67C LS E67B, LA E67B, LO E67B, LY E67B, LB E67C, LV E67C, LT E67C LW T67C LS T679, LY T679, LG T679 LS T770, LO T770, LY T770, LG T770, LP T770 LB T773, LV T773, LT T773, LW T773 LH T774 LS E675, LA E675, LY E675, LS T675 LS T776, LA T776, LO T776, LY T776, LB T776 LHGB T686 LT T68C, LB T68C - Hyper Mini TOPLED® LB M676 - Mini TOPLED Santana® LG M470 LS M47K, LO M47K, LY M47K Source: http://www.osram.convergy.de LUXEON: - LUMILED® LXK2-PW12-R00, LXK2-PW12-S00, LXK2-PW14-U00, LXK2-PW14-V00 LXK2-PM12-R00, LXK2-PM12-S00, LXK2-PM14-U00 LXK2-PE12-Q00, LXK2-PE12-R00, LXK2-PE12-S00, LXK2-PE14-T00, LXK2-PE14-U00 LXK2-PB12-K00, LXK2-PB12-L00, LXK2-PB12-M00, LXK2-PB14-N00, LXK2-PB14-P00, LXK2-PB14-Q00 LXK2-PR12-L00, LXK2-PR12-M00, LXK2-PR14-Q00, LXK2-PR14-R00 LXK2-PD12-Q00, LXK2-PD12-R00, LXK2-PD12-S00 LXK2-PH12-R00, LXK2-PH12-S00 LXK2-PL12-P00, LXK2-PL12-Q00, LXK2-PL12-R00 Source: www.luxeon.com KINGBRIGHT: KA-3528ASYC Source: www.kingbright.com
BOOT = TS-1187A-B-A-B:TS-1187A-B-A-B: Check availability <https://pricing.snapeda.com/parts/TS-1187A-B-A-B/XKB%20Industrial%20Precision/view-part?ref=eda>; AVAILABILITY: Not in stock; CHECK_PRICES: https://www.snapeda.com/parts/TS-1187A-B-A-B/XKB+Connection/view-part/?ref=eda; DESCRIPTION: TS-1187A-B-A-B XKB Connectivity; MF: XKB Industrial Precision; MP: TS-1187A-B-A-B; PACKAGE: Package; PRICE: None; SNAPEDA_LINK: https://www.snapeda.com/parts/TS-1187A-B-A-B/XKB+Connection/view-part/?ref=snap
C1 C6 C8 C13 C108 C110 = rcl:CPOL-EU: POLARIZED CAPACITOR, European symbol
C2-C5 C7 C9-C12 C22 C26 C27 C29 C33 C34 C101 C103 C106 C109 C111 C112 C115 C117-C124 = rcl:C-EU: CAPACITOR, European symbol
C14-C21 C23 C28 C30-C32 = SparkFun-Capacitors:0.1UF: 0.1µF ceramic capacitors A capacitor is a passive two-terminal electrical component used to store electrical energy temporarily in an electric field.; PROD_ID: CAP-08390; VALUE: 0.1uF
C24 C25 = SparkFun-Capacitors:10UF: 10.0µF ceramic capacitors A capacitor is a passive two-terminal electrical component used to store electrical energy temporarily in an electric field.; PROD_ID: CAP-11015; VALUE: 10uF
C100 C102 C104 C105 C107 C113 C114 C116 = rcl:C-EU: CAPACITOR, European symbol; SPICEPREFIX: C
D1-D3 = diode:DIODE-: DIODE
D100 = _hhn_diodes_smd:1N4148WS: 1N4148 General Purpose Rectifie SMD-Version of 1N4148 Case: SOD 323 F Author: Dipl.-Ing. FH Rainer Bayer HHN Hochschule Heilbronn, rainer.bayer@hs-heilbronn.de Ingenieurbüro ing-rb, mail@ing-rb.de
ENCODER = piher:CI-11: 11mm Incemental Encoder Source: www.piher.net .. 04-CI-11v04.pdf
F1 F2 R1-R14 R100-R102 R104-R107 R109-R148 R151 R152 = rcl:R-EU_: RESISTOR, European symbol
IC1 = SparkFun-IC-Memory:W25Q128JVSIQ
IC100 = og-vreg:REG1117: 800mA and 1A Low Dropout (LDO) Positive Regulator 1.8V, 2.5V, 2.85V, 3.3V, 5V, and Adj
IC101 = adafruit:MCP23017: http://ww1.microchip.com/downloads/en/DeviceDoc/21952a.pdf Source: http://ww1.microchip.com/downloads/en/DeviceDoc/21952a.pdf
JP1 JP2 JP100 JP101 = pinhead:PINHD-1X7: PIN HEADER
JP3 JP102 = pinhead:PINHD-1X13: PIN HEADER
JP4 JP5 = pinhead:PINHD-1X15: PIN HEADER
L1-L4 = rcl:L-US: INDUCTOR, American symbol
L5 = SparkFun-Coils:4.7μH_SHIELDED_INDUCTOR: 4.7uH Inductor 4.7uH 1.4A 50mOhm 1008(2520) Package Shielded; PROD_ID: NDUC-14880
LFD36BUE-101B = SparkFun-LED:7-SEGMENT-4DIGIT-20MM: 4 Digit 7 Segment Display This is a part for the 4-Digit 7-segment LEDs from Young Sun. Different from the Digikey LEDs, all 16 pins are used. The LONGPADS Variant is used for a test jig, but you may like it because there is more pad to solder to. If you are concerned about routing space, the standard works just fine though. Datasheets: Red <http://cdn.sparkfun.com/datasheets/Components/LED/1LEDREDCC.pdf> Yellow <http://cdn.sparkfun.com/datasheets/Components/LED/1LEDYELCC.pdf> Green <http://cdn.sparkfun.com/datasheets/Components/LED/1LEDGRNCC.pdf> Blue <http://cdn.sparkfun.com/datasheets/Components/LED/1LEDBLUCC.pdf> White <http://cdn.sparkfun.com/datasheets/Components/LED/1LEDWHTCC.pdf> SparkFun Products Raw Components 7-Segment Display - 20mm (Red) <https://www.sparkfun.com/products/11405> (COM-11405) 7-Segment Display - 20mm (Yellow) <https://www.sparkfun.com/products/11406> (COM-11406) 7-Segment Display - 20mm (Green) <https://www.sparkfun.com/products/11407> (COM-11407) 7-Segment Display - 20mm (Blue) <https://www.sparkfun.com/products/11408> (COM-11408) 7-Segment Display - 20mm (White) <https://www.sparkfun.com/products/11409> (COM-11409) Serial Controlled SparkFun OpenSegment Serial Display - 20mm (Red) <https://www.sparkfun.com/products/11644> (COM-11644) SparkFun OpenSegment Serial Display - 20mm (Yellow) <https://www.sparkfun.com/products/11645> (COM-11645) SparkFun OpenSegment Serial Display - 20mm (Green) <https://www.sparkfun.com/products/11646> (COM-11646) SparkFun OpenSegment Serial Display - 20mm (Blue) <https://www.sparkfun.com/products/11647> (COM-11647) SparkFun OpenSegment Serial Display - 20mm (White) <https://www.sparkfun.com/products/11648> (COM-11648) Other SparkFun OpenSegment Shield <https://www.sparkfun.com/products/13190> (DEV-13190)
OK100 = optocoupler-2(1):HCPL0700: HEWLETT PACKARD OPTO COUPLER
POWER = SparkFun:M05X2: Header 5x2 Standard 10-pin dual row 0.1" header. Commonly used with AVR-ISP. Use with Spark Fun Electronics SKU: PRT-00778
Q100-Q106 = transistor:BC846: NPN TRANSISTOR
R103 R108 R149 R150 R153-R162 = rcl:R-EU_: RESISTOR, European symbol; SPICEPREFIX: R
REG-100 = texas:LM4041: PRECISION MICROPOWER SHUNT VOLTAGE REFERENCE Source: http://focus.ti.com/lit/ds/slcs146e/slcs146e.pdf; MPN: LM4041A12IDBZR; OC_FARNELL: 1407949; OC_NEWARK: 58K5875
U100-U102 = MTM:MCP6002: Generic Dual Op Amp
U$1 = adafruit:BL9342
USB1 = USB-TYPE-C-31-M-12:TYPE-C-31-M-12: Check availability <https://pricing.snapeda.com/parts/TYPE-C-31-M-12/HRO%20Electronics%20Co.%2C%20Ltd./view-part?ref=eda>; AVAILABILITY: Not in stock; CHECK_PRICES: https://www.snapeda.com/parts/TYPE-C-31-M-12/HRO+Electronics+Co.%252C+Ltd./view-part/?ref=eda; DESCRIPTION: USB Connectors 24 Receptacle 1 8.94*7.3mm RoHS; MF: HRO Electronics Co., Ltd.; MP: TYPE-C-31-M-12; PACKAGE: Package; PRICE: None; SNAPEDA_LINK: https://www.snapeda.com/parts/TYPE-C-31-M-12/HRO+Electronics+Co.%252C+Ltd./view-part/?ref=snap
X1 = adafruit_micro:RP2350B
Y1 = microbuilder:CRYSTAL: Crystals HC49UP - Surface Mount Crystal 4.0MHz 18pF +/-30ppm Surface Mount Crystal [Digikey: 535-9857-1-ND] 12.0 MHz Surface Mount Crystal [Digikey: 535-9869-6-ND] 25.0 MHz Surface Mount Crystal [Digikey: 535-9078-1-ND] 2.5 x 2.0mm - MEMs SMT Crystal 16.0 MHz 10pF 20ppm 2.5 x 2.0mm Crystal [Digikey -40-85°C: 535-10923-1-ND] 3.2 x 2.5mm - MEMs SMT Crystal 12.0 MHz 8pF 15ppm 3.2 x 2.5mm Crystal [Digikey: -10-70°C: 644-1047-1-ND -40-125°C: 644-1128-1-ND] 40~85°C cheaper: 644-1173-6-ND 16.0 MHz 8pF 15ppm 3.2 x 2.5mm Crystal [Digikey: -10-70°C: 644-1049-1-ND -40-125°C: 644-1129-2-ND]-40~85°C cheaper: 644-1175-6-ND 16.0 MHz 10pF 10ppm 3.2 x 2.5mm Crystal [Digikey: 644-1100-1-ND] 27.12 MHz 18pF 30ppm 3.2 x 2.5mm Crystal [Digikey: 887-1424-1-ND] 27.12MHz 10pF 10ppm 3.2 x 2.5mm Crystal [Digikey: 887-1329-1-ND] 4.9 x 1.8mm - MEMs SMT Crystal 32.768 KHz 12.5pF 20ppm 4.9 x 1.8mm Crystal [Digikey: SE2415CT-ND] 8.0 x 3.8mm - Surface Mount Crystal 32.768kHz 12.5pF 20ppm -40°C-85°C [Digikey: 535-9166-2-ND] Cylinder 32.768KHz Cylinder Crystal (2x6mm body) [Ex. Digikey: 300-8341-2-ND]